# EAGLE design ToolHeadAdapter2 (EAGLE 9.6.2)
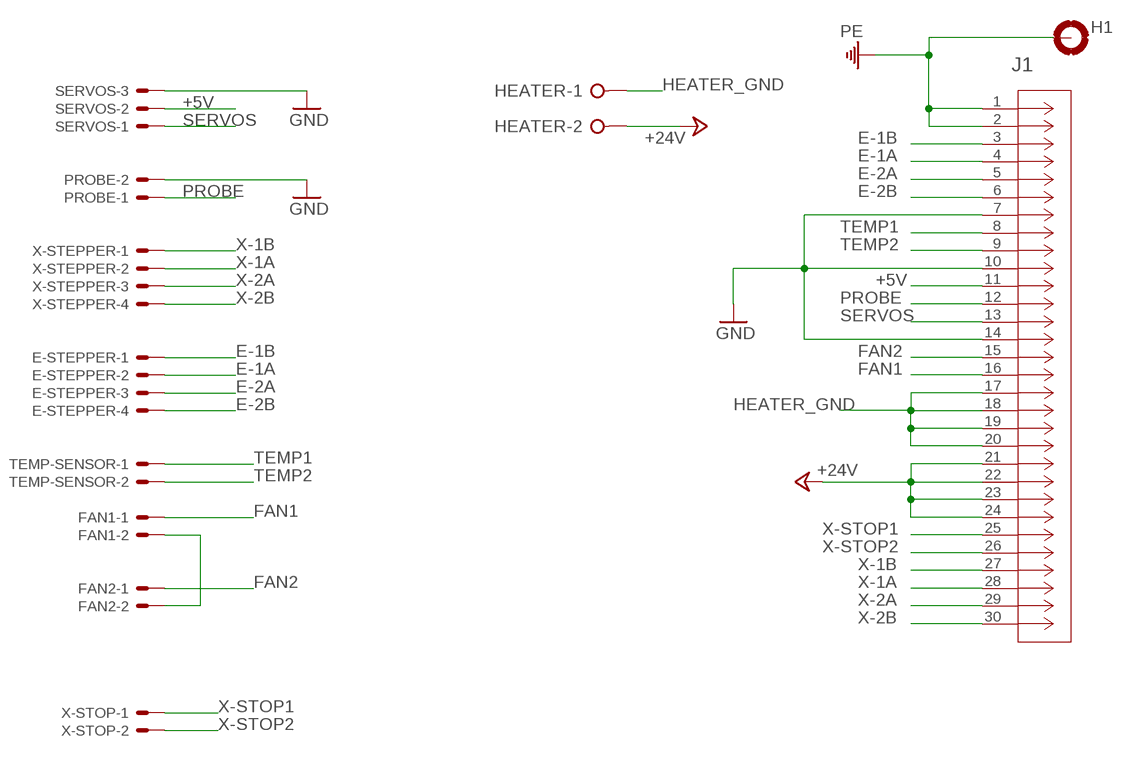
[diagram p0: schematic, sheet 1]

## Parts
E-STEPPER  JST-XH-04-PIN-LONG-PAD  [JST-XH-04-PACKAGE-LONG-PAD]
FAN1  JST-XH-02-PIN-LONG-PAD  [JST-XH-02-PACKAGE-LONG-PAD]
FAN2  JST-XH-02-PIN-LONG-PAD  [JST-XH-02-PACKAGE-LONG-PAD]
H1  MOUNT-PAD-ROUND3.2  [3,2-PAD]
HEATER  W237-02P  [W237-132]
J1  EHT-115-01-S-D  [CONN30_15-01-F-D_SAI]
PROBE  JST-XH-02-PIN-LONG-PAD  [JST-XH-02-PACKAGE-LONG-PAD]
SERVOS  JST-XH-03-PIN-LONG-PAD  [JST-XH-03-PACKAGE-LONG-PAD]
TEMP-SENSOR  JST-XH-02-PIN-LONG-PAD  [JST-XH-02-PACKAGE-LONG-PAD]
X-STEPPER  JST-XH-04-PIN-LONG-PAD  [JST-XH-04-PACKAGE-LONG-PAD]
X-STOP  JST-XH-02-PIN-LONG-PAD  [JST-XH-02-PACKAGE-LONG-PAD]

## Nets
+5V: J1.11 SERVOS.2
+24V: HEATER.2 J1.21 J1.22 J1.23 J1.24
E-1A: E-STEPPER.2 J1.4
E-1B: E-STEPPER.1 J1.3
E-2A: E-STEPPER.3 J1.5
E-2B: E-STEPPER.4 J1.6
FAN1: FAN1.1 J1.16
FAN2: FAN2.1 J1.15
GND: J1.7 J1.10 J1.14 PROBE.2 SERVOS.3
HEATER_GND: HEATER.1 J1.17 J1.18 J1.19 J1.20
N$1: FAN1.2 FAN2.2
PE: H1.B3,2(MOUNT) J1.1 J1.2
PROBE: J1.12 PROBE.1
SERVOS: J1.13 SERVOS.1
TEMP1: J1.8 TEMP-SENSOR.1
TEMP2: J1.9 TEMP-SENSOR.2
X-1A: J1.28 X-STEPPER.2
X-1B: J1.27 X-STEPPER.1
X-2A: J1.29 X-STEPPER.3
X-2B: J1.30 X-STEPPER.4
X-STOP1: J1.25 X-STOP.1
X-STOP2: J1.26 X-STOP.2

## Library data of the parts
E-STEPPER X-STEPPER = Rembrandt Electronics - JST XH Connectors v1-0:JST-XH-04-PIN: JST XH Connector 2 Pin Wire to board connector. Pitch: 2,54 mm, (0.100") Number of pins: 4 Created by Rembrandt Electronics www.rembrandtelectronics.com
FAN1 FAN2 PROBE TEMP-SENSOR X-STOP = Rembrandt Electronics - JST XH Connectors v1-0:JST-XH-02-PIN: JST XH Connector 2 Pin Wire to board connector. Pitch: 2,54 mm, (0.100") Number of pins: 2 Created by Rembrandt Electronics www.rembrandtelectronics.com
H1 = holes:MOUNT-PAD-ROUND: MOUNTING PAD, round
HEATER = con-wago-508:W237-02P: WAGO SREW CLAMP; OC_FARNELL: unknown; OC_NEWARK: unknown
J1 = EHT-115-01-S-D:EHT-115-01-S-D; COPYRIGHT: Copyright (C) 2022 Ultra Librarian. All rights reserved.; MANUFACTURER_PART_NUMBER: EHT-115-01-S-D; MFR_NAME: Samtec Inc
SERVOS = Rembrandt Electronics - JST XH Connectors v1-0:JST-XH-03-PIN: JST XH Connector 2 Pin Wire to board connector. Pitch: 2,54 mm, (0.100") Number of pins: 3 Created by Rembrandt Electronics www.rembrandtelectronics.com

## Board
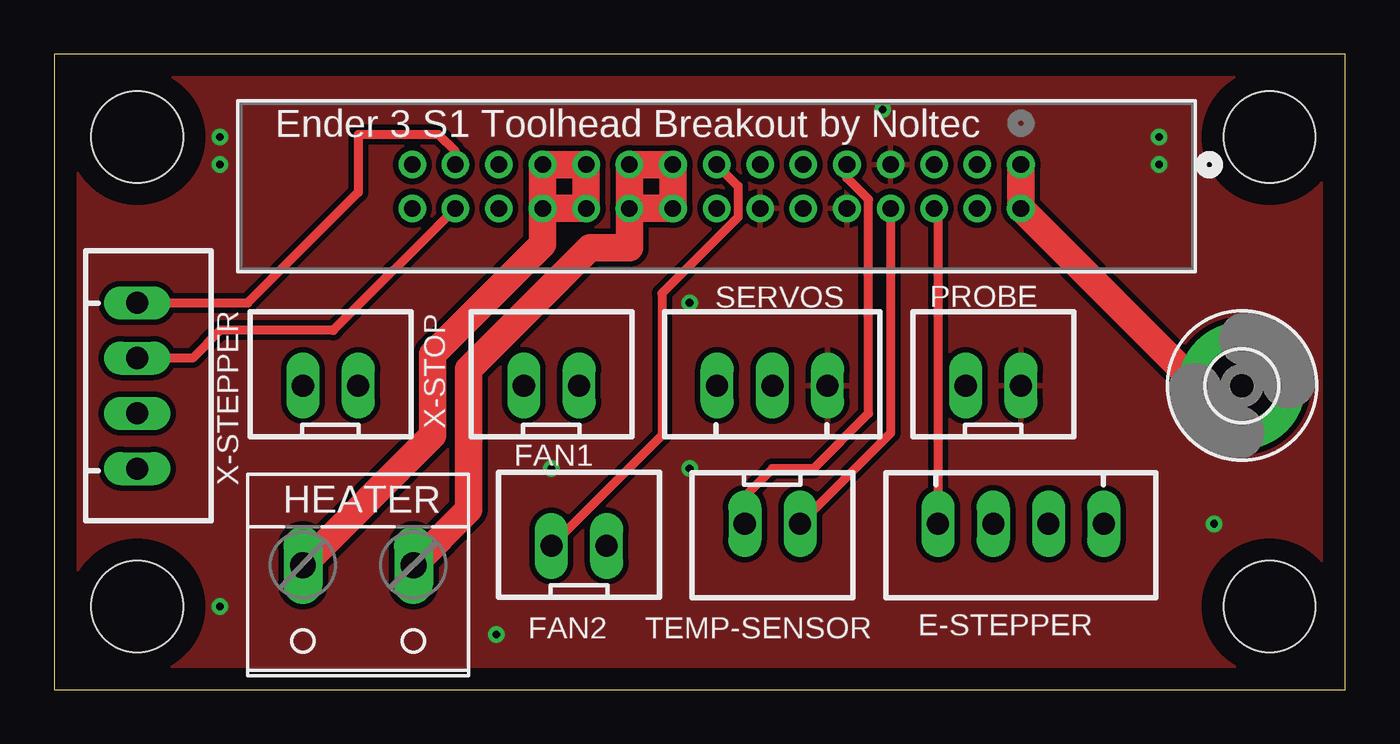
[diagram p1: board, top side]
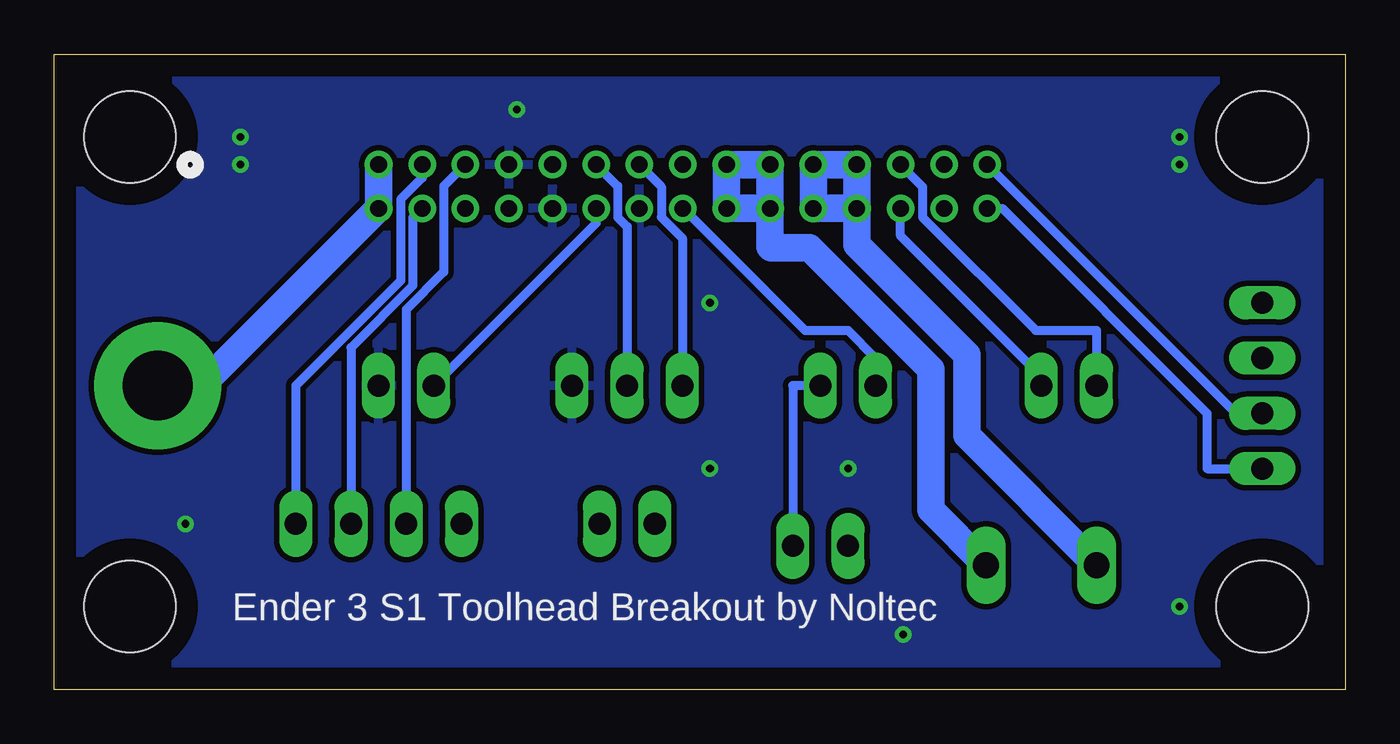
[diagram p2: board, bottom side, seen from below]

Size 59.36 x 29.2 mm. Coordinates in mm from the lower left corner, seen from the top.
Outline: 0,0 59.36,0 59.36,29.2 0,29.2 0,0
Copper layers (1*16): Top 0.035mm / dielectric 0.15mm / Bottom 0.035mm
Design rules "default": minimum track width 6mil, minimum drill 0.35mm, track to track 6mil, track to pad 6mil, pad to pad 6mil, via to via 6mil, smd to smd 6mil, copper to edge 40mil, drill to drill 6mil, minimum pad ring 10mil, minimum via ring 8mil, stop-mask expansion 4mil, vias tented up to drill 0mil, thermal gap 10mil
Holes 4.2 mm at 3.81,25.4 3.81,3.81 55.88,25.4 55.88,3.81

### Footprints (pad centres in the part's own frame; a part is rotated, then mirrored left to right if it is on the bottom)
JST-XH-04-PACKAGE-LONG-PAD = drill 1.016 long: 1 -3.81,0; 2 -1.27,0; 3 1.27,0; 4 3.81,0
JST-XH-02-PACKAGE-LONG-PAD = drill 1.016 long: 1 -1.27,0; 2 1.27,0
3,2-PAD = drill 3.2 pad 5.842: B3,2 0,0
W237-132 = drill 1.194 long: 1 -2.54,-0.635; 2 2.54,-0.635
CONN30_15-01-F-D_SAI = drill 0.762 pad 1.27: 1 0,0; 2 0,2.007; 3 2.007,0; 4 2.007,2.007; 5 3.988,0; 6 3.988,2.007; 7 5.994,0; 8 5.994,2.007; 9 8.001,0; 10 8.001,2.007; 11 10.008,0; 12 10.008,2.007; 13 11.989,0; 14 11.989,2.007; 15 13.995,0; 16 13.995,2.007; 17 16.002,0; 18 16.002,2.007; 19 18.009,0; 20 18.009,2.007; 21 19.99,0; 22 19.99,2.007; 23 21.996,0; 24 21.996,2.007; 25 24.003,0; 26 24.003,2.007; 27 26.01,0; 28 26.01,2.007; 29 27.991,0; 30 27.991,2.007
JST-XH-03-PACKAGE-LONG-PAD = drill 1.016 long: 1 -2.54,0; 2 0,0; 3 2.54,0

### Placement (x,y rotation side)
E-STEPPER  44.45,7.62 180 top
FAN1  22.86,13.97 0 top
FAN2  24.13,6.6 0 top
H1  54.61,13.97 0 top
HEATER  13.97,5.08 180 top
J1  44.45,24.13 180 top
PROBE  43.18,13.97 0 top
SERVOS  33.02,13.97 0 top
TEMP-SENSOR  33.02,7.62 180 top
X-STEPPER  3.81,13.97 270 top
X-STOP  12.7,13.97 0 top

### Tracks (layer width: path | path; a pad name or v marks a point on that pad's centre or on a via)
+5V
  Bottom 0.406: SERVOS.2 33.02,21.28 33.45,21.71 33.45,23.14 J1.11
+24V
  Top 1.27: J1.24 J1.22 J1.21 J1.23 J1.24 | J1.24 22.45,20.47 17.4,15.41 17.4,11.68 HEATER.2
  Bottom 1.27: HEATER.2 17.4,11.68 17.4,15.39 22.45,20.44 J1.24 | J1.24 J1.23 J1.21 J1.22 J1.24
E-1A
  Bottom 0.406: J1.4 42.88,21.69 42.88,18.57 45.72,15.72 E-STEPPER.2
E-1B
  Bottom 0.406: J1.3 42.44,23.52 43.43,22.53 43.43,18.8 48.26,13.97 E-STEPPER.1
E-2A
  Bottom 0.406: E-STEPPER.3 43.18,17.47 41.45,19.2 41.45,23.14 J1.5
E-2B
  Top 0.406: J1.6 40.64,21.95 E-STEPPER.4
FAN1
  Bottom 0.406: J1.16 24.84,16.51 22.86,16.51 21.59,15.24 FAN1.1
FAN2
  Top 0.406: FAN2.1 27.94,11.68 27.94,18.21 31.45,21.71 31.45,23.14 J1.15
GND  (via drill 0.35)
  other vias: 20.32,2.54 7.62,3.81 7.62,25.4 7.62,24.13 38.1,26.67 22.86,10.16 29.21,10.16 50.8,24.13 50.8,25.4 53.34,7.62 29.21,17.78
  pour Top (isolate 0.254): 0,31.75 0,0 59.69,0 59.69,31.75
  pour Bottom (isolate 0.254): 0,30.48 0,0 59.69,0 59.69,30.48
HEATER_GND
  Top 1.27: J1.20 J1.18 J1.17 J1.19 J1.20 | HEATER.1 19.05,8.26 19.05,14.73 24.64,20.32 26.44,20.32 J1.20
  Bottom 1.27: HEATER.1 19.05,8.26 19.05,14.73 24.64,20.32 26.42,20.32 26.44,20.34 J1.20 | J1.20 J1.18 J1.17 J1.19 J1.20
N$1
  Bottom 0.406: FAN1.2 25.4,13.97 FAN2.2
PE
  Top 1.27: J1.1 J1.2 52.6,13.97 H1.B3,2
  Bottom 1.27: J1.1 J1.2 52.6,13.97 H1.B3,2
PROBE
  Bottom 0.406: J1.12 34.44,21.44 PROBE.1
SERVOS
  Bottom 0.406: J1.13 31.45,23.11 31.45,21.71 30.48,20.75 SERVOS.1
TEMP1
  Top 0.406: J1.8 38.46,11.79 TEMP-SENSOR.1
TEMP2
  Top 0.406: J1.9 36.45,23.52 37.44,22.53 37.44,12.7 34.9,10.16 33.02,10.16 31.75,8.89 TEMP-SENSOR.2
X-1A
  Top 0.406: J1.28 12.83,16.51 7.62,16.51 6.35,15.24 X-STEPPER.2
X-1B
  Top 0.406: X-STEPPER.1 8.89,17.78 13.97,22.86 13.97,25.53 17.65,25.53 18.44,24.74 J1.27
X-2A
  Bottom 0.406: J1.29 5.03,12.7 X-STEPPER.3
X-2B
  Bottom 0.406: J1.30 15.77,22.12 6.35,12.7 6.35,10.16 X-STEPPER.4
X-STOP1
  Bottom 0.406: J1.25 19.43,23.11 19.43,21.71 14.23,16.51 11.43,16.51 X-STOP.1
X-STOP2
  Bottom 0.406: X-STOP.2 13.97,14.38 20.45,20.85 J1.26

### Text on the board
tNames: Ender 3 S1 Toolhead Breakout by Noltec
bNames: Ender 3 S1 Toolhead Breakout by Noltec